# Altium schematic sheet 06_PowerRele_OnOff.SchDoc
size A4; Organization: OLTEST; Revision: 01; SheetNumber: 6; SheetTotal: 13; Название листа: Название листа; Разработчик: Бондарчук С.; Прибор: R100; АМАК.000000.000 Э3: R100.230.030.000-00; Дата: 16.04.2019; Формат: A4; Workspacename: R100_Boards_v1; PageSetup: Record=PageOptions|CenterHorizontal=True|CenterVertical=True|PrintScale=0.97|XCorrection=1.00|YCorrection=1.00|PrintKind=0|BorderSize=5000000|LeftOffset=0|BottomOffset=0|Orientation=2|PaperLength=1000|PaperWidth=1000|Scale=100|PaperSource=7|PrintQuality=-3|MediaType=1|DitherType=10|PrintScaleMode=1|PaperKind=A4|PaperIndex=9
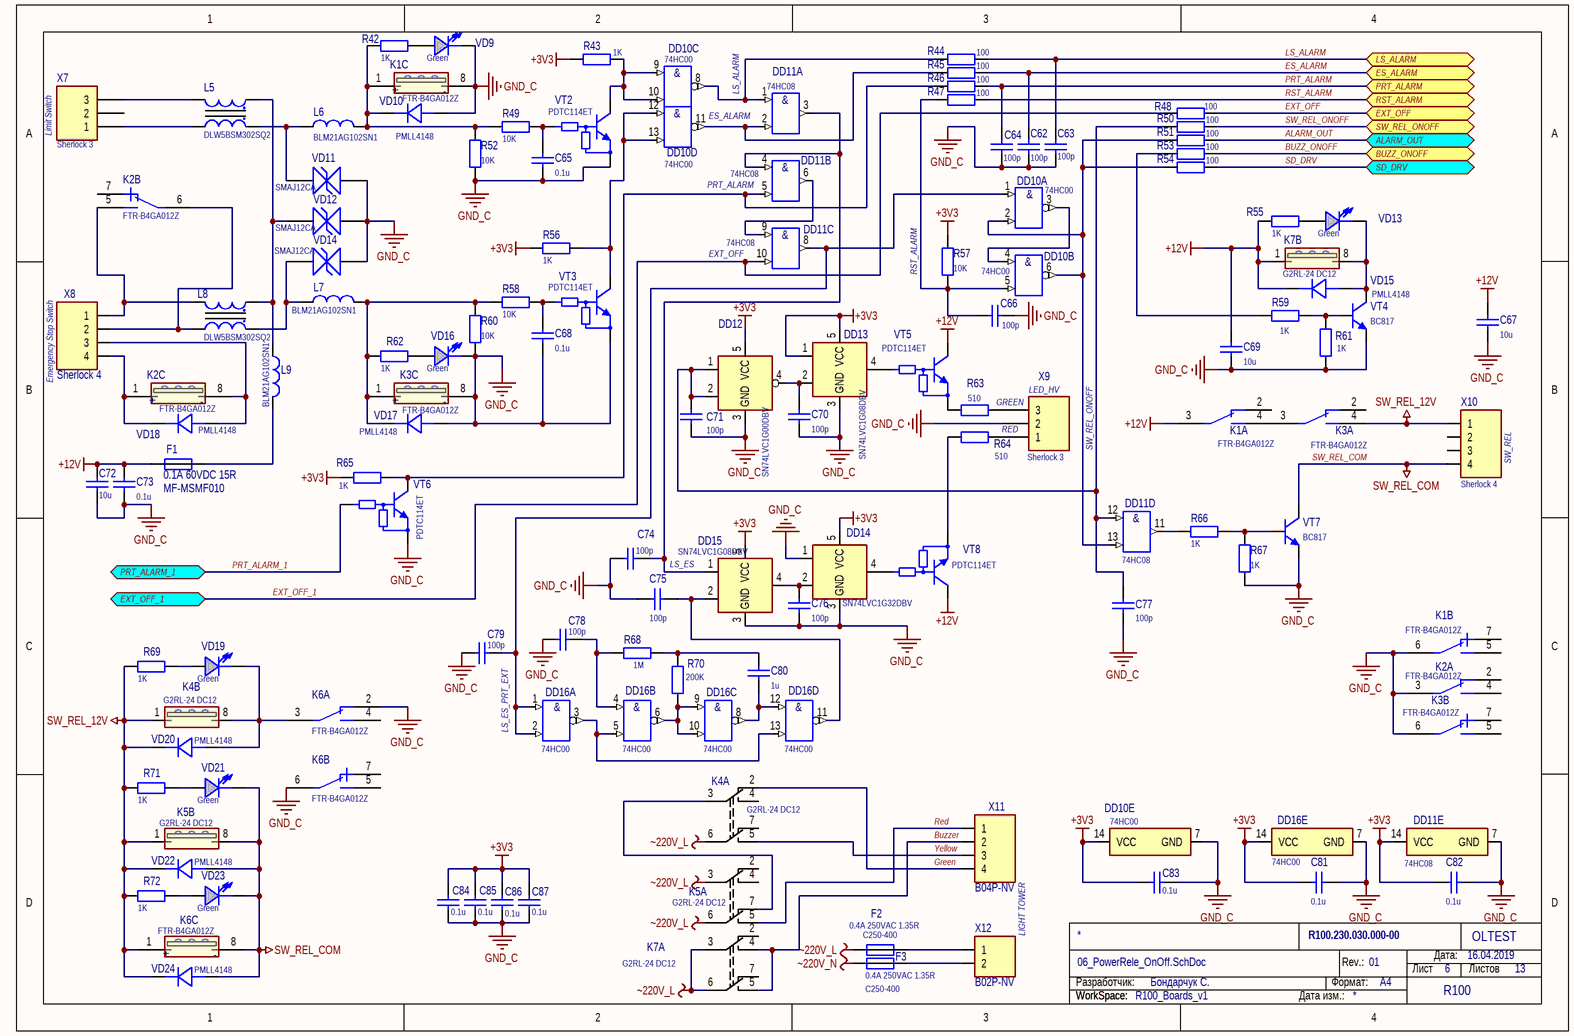
[diagram p0: 06_PowerRele_OnOff.SchDoc]

## Parts
C62  100p  [SMD_C_0603]
C63  100p  [SMD_C_0603]
C64  100p  [SMD_C_0603]
C65  0.1u  [SMD_C_0603]
C66  100p  [SMD_C_0603]
C67  10u  [SMD_C_1206]
C68  0.1u  [SMD_C_0603]
C69  10u  [SMD_C_1206]
C70  100p  [SMD_C_0603]
C71  100p  [SMD_C_0603]
C72  10u  [SMD_C_1206]
C73  0.1u  [SMD_C_0603]
C74  100p  [SMD_C_0603]
C75  100p  [SMD_C_0603]
C76  100p  [SMD_C_0603]
C77  100p  [SMD_C_0603]
C78  100p  [SMD_C_0603]
C79  100p  [SMD_C_0603]
C80  1u  [SMD_C_0603]
C81  0.1u  [SMD_C_0603]
C82  0.1u  [SMD_C_0603]
C83  0.1u  [SMD_C_0603]
C84  0.1u  [SMD_C_0603]
C85  0.1u  [SMD_C_0603]
C86  0.1u  [SMD_C_0603]
C87  0.1u  [SMD_C_0603]
DD10  74HC00  [TSSOP14]  (parts A,B,C,D,E of 5)
DD11  74HC08  [TSSOP14]  (parts A,B,C,D,E of 5)
DD12  SN74LVC1G00DBV  [SOT-23(DBV)]
DD13  SN74LVC1G08DBV  [SOT-23(DBV)]
DD14  SN74LVC1G32DBV  [SOT-23(DBV)]
DD15  SN74LVC1G08DBV  [SOT-23(DBV)]
DD16  74HC00  [TSSOP14]  (parts A,B,C,D,E of 5)
F1  0.1A 60VDC 15R  [MF-MSMF010]
F2  0.4A 250VAC 1.35R  [C250-400]
F3  0.4A 250VAC 1.35R  [C250-400]
K1  FTR-B4GA012Z  [FTR-B4GA]  (parts A,B,C of 3)
K2  FTR-B4GA012Z  [FTR-B4GA]  (parts A,B,C of 3)
K3  FTR-B4GA012Z  [FTR-B4GA]  (parts A,B,C of 3)
K4  G2RL-24 DC12  [G2RL]  (parts A,B of 2)
K5  G2RL-24 DC12  [G2RL]  (parts A,B of 2)
K6  FTR-B4GA012Z  [FTR-B4GA]  (parts A,B,C of 3)
K7  G2RL-24 DC12  [G2RL]  (parts A,B of 2)
L5  DLW5BSM302SQ2  [DLW5BS(AH)]
L6  BLM21AG102SN1  [SMD_L_L2_W1.25]
L7  BLM21AG102SN1  [SMD_L_L2_W1.25]
L8  DLW5BSM302SQ2  [DLW5BS(AH)]
L9  BLM21AG102SN1  [SMD_L_L2_W1.25]
R42  1K  [SMD_R_1206]
R43  1K  [SMD_R_0603]
R44  100  [SMD_R_0603]
R45  100  [SMD_R_0603]
R46  100  [SMD_R_0603]
R47  100  [SMD_R_0603]
R48  100  [SMD_R_0603]
R49  10K  [SMD_R_0603]
R50  100  [SMD_R_0603]
R51  100  [SMD_R_0603]
R52  10K  [SMD_R_0603]
R53  100  [SMD_R_0603]
R54  100  [SMD_R_0603]
R55  1K  [SMD_R_1206]
R56  1K  [SMD_R_0603]
R57  10K  [SMD_R_0603]
R58  10K  [SMD_R_0603]
R59  1K  [SMD_R_0805]
R60  10K  [SMD_R_0603]
R61  1K  [SMD_R_0805]
R62  1K  [SMD_R_1206]
R63  510  [SMD_R_1206]
R64  510  [SMD_R_1206]
R65  1K  [SMD_R_0603]
R66  1K  [SMD_R_0805]
R67  1K  [SMD_R_0805]
R68  1M  [SMD_R_0805]
R69  1K  [SMD_R_1206]
R70  200K  [SMD_R_0805]
R71  1K  [SMD_R_1206]
R72  1K  [SMD_R_1206]
VD9  value Green  [SMD_LED_LL_Green]  (hidden comment: LL-S172GC-2A)
VD10  PMLL4148  [SOD80C]
VD11  SMAJ12CA  [DO-214AC noPolarity]
VD12  SMAJ12CA  [DO-214AC noPolarity]
VD13  value Green  [SMD_LED_LL_Green]  (hidden comment: LL-S172GC-2A)
VD14  SMAJ12CA  [DO-214AC noPolarity]
VD15  PMLL4148  [SOD80C]
VD16  value Green  [SMD_LED_LL_Green]  (hidden comment: LL-S172GC-2A)
VD17  PMLL4148  [SOD80C]
VD18  PMLL4148  [SOD80C]
VD19  value Green  [SMD_LED_LL_Green]  (hidden comment: LL-S172GC-2A)
VD20  PMLL4148  [SOD80C]
VD21  value Green  [SMD_LED_LL_Green]  (hidden comment: LL-S172GC-2A)
VD22  PMLL4148  [SOD80C]
VD23  value Green  [SMD_LED_LL_Green]  (hidden comment: LL-S172GC-2A)
VD24  PMLL4148  [SOD80C]
VT2  PDTC114ET  [SOT23-3]
VT3  PDTC114ET  [SOT23-3]
VT4  BC817  [SOT23-3]
VT5  PDTC114ET  [SOT23-3]
VT6  PDTC114ET  [SOT23-3]
VT7  BC817  [SOT23-3]
VT8  PDTC114ET  [SOT23-3]
X7  Sherlock 3  [35362-0350]
X8  Sherlock 4  [35362-0450]
X9  Sherlock 3  [35362-0350]
X10  Sherlock 4  [35362-0450]
X11  B04P-NV  [B04P-NV (power)]
X12  B02P-NV  [B02P-NV]

## Ports
ALARM_OUT, BUZZ_ONOFF, ES_ALARM, EXT_OFF, EXT_OFF_1, LS_ALARM, PRT_ALARM, PRT_ALARM_1, RST_ALARM, SD_DRV (bidir), SW_REL_ONOFF

## Nets
+3V3: C81.1 C82.1 C83.1 C84.2 C85.2 C86.2 C87.2 DD10.14(VCC) DD11.14(VCC) DD12.5(VCC) DD13.1 DD13.5(VCC) DD14.5(VCC) DD15.5(VCC) DD16.14(VCC) R43.2 R56.2 R57.1 R65.2
+12V: C67.2 C69.2 C72.2 C73.2 F1.1 K1.3 K7.1 R55.1 VD15.2(CATHODE) VT5.3(C) VT8.3(C)
GND_C: C62.1 C63.1 C64.1 C65.1 C66.1 C67.1 C68.1 C69.1 C70.2 C71.1 C72.1 C73.1 C74.2 C75.2 C76.2 C77.2 C78.2 C79.2 C81.2 C82.2 C83.2 C84.1 C85.1 C86.1 C87.1 DD10.7(GND) DD11.7(GND) DD12.3(GND) DD13.3(GND) DD14.1 DD14.3(GND) DD15.3(GND) DD16.7(GND) K1.6 K1.8 K2.3 K3.6 K3.8 K6.2 K6.6 R52.1 R60.1 R61.1 R67.1 VD9.2(CATHODE) VD10.1(ANODE) VD11.2 VD12.2 VD14.2 VD16.2(CATHODE) VD17.1(ANODE) VT2.2(E) VT3.2(E) VT4.2(E) VT6.2(E) VT7.2(E) X9.2
SW_REL_12V: K3.4 K4.1 K5.1 K6.1 R69.1 R71.1 R72.1 VD20.2(CATHODE) VD22.2(CATHODE) VD24.2(CATHODE) X10.1
SW_REL_COM: K5.8 K6.8 VD21.2(CATHODE) VD22.1(ANODE) VD23.2(CATHODE) VD24.1(ANODE) VT7.3(C) X10.4
~220V_L: F2.1 K4.6 K5.3 K5.6 K7.3 K7.6
~220V_N: F3.1
ALARM_OUT: R51.2 ; port ALARM_OUT
BUZZ_ONOFF: R53.2 ; port BUZZ_ONOFF
Buzzer: K7.4 K7.5 X11.2
ES_ALARM: C62.2 R45.2 ; port ES_ALARM
EXT_OFF: R48.2 ; port EXT_OFF
EXT_OFF_1: DD11.10(3B) R48.1 ; port EXT_OFF_1
Green: K4.2 X11.4
LS_ALARM: C63.2 R44.2 ; port LS_ALARM
PRT_ALARM: C64.2 R46.2 ; port PRT_ALARM
PRT_ALARM_1: VT6.1(B) ; port PRT_ALARM_1
Red: K5.5 X11.1
RST_ALARM: R47.2 ; port RST_ALARM
SD_DRV: R54.2 ; port SD_DRV
SW_REL_ONOFF: R50.2 ; port SW_REL_ONOFF
Yellow: K4.5 X11.3
NetC65_2: C65.2 R49.2 VT2.1(B)
NetC66_2: C66.2 DD10.5(2B) R47.1 R57.2
NetC68_2: C68.2 R58.2 VT3.1(B)
NetC70_1: C70.1 DD12.4 DD13.2
NetC71_2: C71.2 C77.1 DD11.12(4A) DD12.1 DD12.2 R50.1
NetC74_1: C74.1 DD11.3(1Y) DD11.4(2A) DD15.1
NetC75_1: C75.1 DD15.2 DD16.11(4Y)
NetC76_1: C76.1 DD14.2 DD15.4
NetC78_1: C78.1 DD16.4(2A) R68.1
NetC79_1: C79.1 DD10.1(1A) DD11.8(3Y) DD16.1(1A) DD16.2(1B)
NetC80_1: C80.1 DD16.8(3Y) DD16.12(4A)
NetC80_2: C80.2 R68.2 R70.2
NetDD10_2: DD10.2(1B) DD10.6(2Y) DD11.13(4B) R51.1 R54.1
NetDD10_3: DD10.3(1Y) DD10.4(2A)
NetDD10_8: DD10.8(3Y) DD11.1(1A) R44.1
NetDD10_9: DD10.9(3A) DD10.10(3B) R43.1 VT2.3(C)
NetDD10_11: DD10.11(4Y) DD11.2(1B) R45.1
NetDD10_12: DD10.12(4A) DD10.13(4B) R56.1 VT3.3(C)
NetDD11_5: DD11.5(2B) R46.1 R65.1 VT6.3(C)
NetDD11_6: DD11.6(2Y) DD11.9(3A)
NetDD11_11: DD11.11(4Y) R66.1
NetDD13_4: DD13.4 VT5.1(B)
NetDD14_4: DD14.4 VT8.1(B)
NetDD16_3: DD16.3(1Y) DD16.5(2B) DD16.13(4B)
NetDD16_6: DD16.6(2Y) DD16.9(3A) DD16.10(3B) R70.1
NetF1_2: F1.2 L9.2
NetF2_2: F2.2 X12.1
NetF3_2: F3.2 X12.2
NetK1_1: K1.1 L6.2 R42.1 R49.1 R52.2 VD10.2(CATHODE)
NetK1_4: K1.4 K3.3
NetK2_1: K2.1 VD18.2(CATHODE) X8.4
NetK2_5: K2.5 L8.2 X8.1
NetK2_6: K2.6 L8.3 X8.2
NetK2_8: K2.8 VD18.1(ANODE) X8.3
NetK3_1: K3.1 L7.2 R58.1 R60.2 R62.1 VD17.2(CATHODE)
NetK4_3: K4.3 K5.7
NetK4_8: K4.8 K6.3 VD19.2(CATHODE) VD20.1(ANODE)
NetK7_8: K7.8 VD13.2(CATHODE) VD15.1(ANODE) VT4.3(C)
NetL5_1: L5.1 L6.1 VD11.1
NetL5_2: L5.2 X7.1
NetL5_3: L5.3 X7.3
NetL5_4: L5.4 L8.1 L9.1 VD12.1
NetL7_1: L7.1 L8.4 VD14.1
NetR42_2: R42.2 VD9.1(ANODE)
NetR53_1: R53.1 R59.1
NetR55_2: R55.2 VD13.1(ANODE)
NetR59_2: R59.2 R61.2 VT4.1(B)
NetR62_2: R62.2 VD16.1(ANODE)
NetR63_1: R63.1 VT5.2(E)
NetR63_2: R63.2 X9.3
NetR64_1: R64.1 VT8.2(E)
NetR64_2: R64.2 X9.1
NetR66_2: R66.2 R67.2 VT7.1(B)
NetR69_2: R69.2 VD19.1(ANODE)
NetR71_2: R71.2 VD21.1(ANODE)
NetR72_2: R72.2 VD23.1(ANODE)

Not connected (* = marked no-connect by the designer): K1 2 5 7; K2 2 4 7; K3 2 5 7; K4 4 7; K5 2 4; K6 4 5 7; K7 2 7; X7 2; X10 2 3

## Notes on the sheet
- LS_ALARM
- (near X7) Limit Switch
- (near DD10) ES_ALARM
- (near DD11) PRT_ALARM
- (near DD11) EXT_OFF
- (near R57) RST_ALARM
- (near X8) Emergency Stop Switch
- GREEN
- RED
- (near X9) LED_HV
- SW_REL_ONOFF
- (near X10) SW_REL
- LS_ES
- LS_ES_PRT_EXT
- LIGHT TOWER
- Разработчик:
- Формат:
- Rev.:
- Лист
- Дата:
- Листов
- WorkSpace:
- Дата изм.:
- (in symbol 74HC00, part A) &
- (in symbol 74HC00, part B) &
- (in symbol 74HC00, part C) &
- (in symbol 74HC00, part D) &
- (in symbol 74HC08, part A) &
- (in symbol 74HC08, part B) &
- (in symbol 74HC08, part C) &
- (in symbol 74HC08, part D) &
- (in symbol FTR-B4GA012Z, part C) -; +
- (in symbol SN74LVC1G00DBV) &
- (in symbol SN74LVC1G08DBV) &

## Library data of the parts
C62-C64 C66 C70 C71 C74-C79 = C0603 100p 100V 5%: SMD C 0603 MURATA 100V 5% NP0; PartNumber: GRM1885C2A101JA01; Manufacturer: MURATA; Value: 100p
C65 C68 C73 C81-C87 = C0603 0.1u 50V 10%: SMD C 0603 MURATA 50V 10% X7R; PartNumber: GRM188R71H104K; Manufacturer: MURATA; Value: 0.1u
C67 C69 C72 = C1206 10u 25V 20%: SMD C 1206 MURATA 25V 20% X5R; PartNumber: GRM31MR61E106M; Manufacturer: MURATA; Value: 10u
C80 = C0603 1uF 25V 10%: SMD C 0603 MURATA 25V 10% X7R; PartNumber: GRM188R71E105KA12; Manufacturer: MURATA; Value: 1u
DD10 DD16 = 74HC00: Quad 2-Input Positive-NAND Gates, PW0014A; Generic Part Number: SN74HC00; Manufacturer: Texas Instruments; PartNumber: SN74HC00PW; VCC(Min)(V): 2; VCC(Max)(V): 6; Output Type: CMOS; ICC @ Nom Voltage(Max)(mA): 0.02; Bits(#): 4; F @ Nom Voltage(Max)(Mhz): 70; Technology Family: HC; Voltage(Nom)(V): 5; Schmitt Trigger: Yes; Output Drive (IOL/IOH)(Max)(mA): 5.2/-5.2; tpd @ Nom Voltage(Max)(ns): 23; PackageReference: PW0014A; Input Type: CMOS; Operating Temperature Range(C): -40 to 85
DD11 = 74HC08: Quad 2-Input Positive-NAND Gates, PW0014A; Generic Part Number: SN74HC00; Manufacturer: Texas Instruments; PartNumber: SN74HC08PW; VCC(Min)(V): 2; VCC(Max)(V): 6; Output Type: CMOS; ICC @ Nom Voltage(Max)(mA): 0.02; Bits(#): 4; F @ Nom Voltage(Max)(Mhz): 70; Technology Family: HC; Voltage(Nom)(V): 5; Schmitt Trigger: Yes; Output Drive (IOL/IOH)(Max)(mA): 5.2/-5.2; tpd @ Nom Voltage(Max)(ns): 23; PackageReference: PW0014A; Input Type: CMOS; Operating Temperature Range(C): -40 to 85
DD12 = SN74LVC1G00DBV: 2-in NAND; Manufacturer: Texas Instruments; PartNumber: SN74LVC1G00DBV
DD13 DD15 = SN74LVC1G08DBV: 2-in AND; Manufacturer: Texas Instruments; PartNumber: SN74LVC1G08DBV
DD14 = SN74LVC1G32DBV: 2-in OR; Manufacturer: Texas Instruments; PartNumber: SN74LVC1G32DBV
F1 = MF-MSMF010 (0.1A 60VDC 15R): PTC Resettable Fusses 0.1A 60VDC 15R; Manufacturer: BOURNS; PartNumber: MF-MSMF010
F2 F3 = C250-400 (0.4A 250VAC 1.35R): PTC Resettable Fusses 0.4A 250VAC 1.35R; Manufacturer: SEA&LAND ELECTRONIC CORP.; PartNumber: C250-400
K1-K3 K6 = FTR-B4GA012Z: 250VAC 1A DPDT 12VDC; Manufacturer: Fujitsu; PartNumber: FTR-B4GA012Z
K4 K5 K7 = G2RL-24 DC12: 440VAC 8A DPDT 12VDC; Manufacturer: Omron; PartNumber: G2RL-24 DC12
L5 L8 = DLW5BSM302SQ2: SMD Common Mode Choke Coil 0.5A Z = 3000 Ohm / 100 MHz; Manufacturer: MURATA; PartNumber: DLW5BSM302SQ2
L6 L7 L9 = BLM21AG102SN1: 1000R 0.6A (100MHz); Manufacturer: TDK; Value: 1000R 0.6A (100MHz); PartNumber: BLM21AG102SN1
R42 R55 R62 R69 R71 R72 = R1206 1K 1%: SMD R 1206 VISHAY 0.25W 200V 1% 100ppm; PartNumber: CRCW12061K00FK; Manufacturer: VISHAY; Value: 1K
R43 R56 R65 = R0603 1K 1%: SMD R 0603 VISHAY 0.1W 75V 1% 100ppm; PartNumber: CRCW06031K00FK; Manufacturer: VISHAY; Value: 1K
R44-R48 R50 R51 R53 R54 = R0603 100 1%: SMD R 0603 VISHAY 0.1W 75V 1% 100ppm; PartNumber: CRCW0603100RFK; Manufacturer: VISHAY; Value: 100
R49 R52 R57 R58 R60 = R0603 10К 1%: SMD R 0603 VISHAY 0.1W 75V 1% 100ppm; PartNumber: CRCW060310K0FK; Manufacturer: VISHAY; Value: 10K
R59 R61 R66 R67 = R0805 1K 1%: SMD R 0805 VISHAY 0.125W 150V 1% 100ppm; PartNumber: CRCW08051K00FK; Manufacturer: VISHAY; Value: 1K
R63 R64 = R1206 510 1%: SMD R 1206 VISHAY 0.25W 200V 1% 100ppm; PartNumber: CRCW1206510RFK; Manufacturer: VISHAY; Value: 510
R68 = R0805 1M 1%: SMD R 0805 VISHAY 0.125W 150V 1% 100ppm; PartNumber: CRCW08051M00FK; Manufacturer: VISHAY; Value: 1M
R70 = R0805 200K 1%: SMD R 0805 VISHAY 0.125W 150V 1% 100ppm; PartNumber: CRCW0805200KFK; Manufacturer: VISHAY; Value: 200K
VD9 VD13 VD16 VD19 VD21 VD23 = LL-S172GC-2A: LED Green SMD; Manufacturer: Lucky Light; PartNumber: LL-S172GC-2A
VD10 VD15 VD17 VD18 VD20 VD22 VD24 = PMLL4148: If=0.2A, Vf=1V Vrrm=100V Diode (SOD80C); Manufacturer: NXP Semiconductors; PartNumber: PMLL4148
VD11 VD12 VD14 = SMAJ12CA: 400W 12V  Transient Voltage Suppressor, Bidirectional; Manufacturer: LITTELFUSE; PartNumber: SMAJ12CA
VT2 VT3 VT5 VT6 VT8 = PDTC114ET: Digital Transistor (BRT), R1=10 kOhm, R2=10 kOhm, NPN Transistor; Manufacturer: On Semiconductor; PartNumber: PDTC114ET
VT4 VT7 = BC817: NPN Silicon, 3-Pin SOT-23; Manufacturer: NXP; PartNumber: BC817
X7 X9 = 35362-0350: Sherlock 3 Top, 2A 125V 2mm; Manufacturer: MOLEX; PartNumber: 35362-0350
X8 X10 = 35362-0450: Sherlock 4 Top, 2A 125V 2mm; Manufacturer: MOLEX; PartNumber: 35362-0450
X11 = B04P-NV: NV 4 конт LS=5.0 10A 250V PCB; Manufacturer: JST; PartNumber: B04P-NV
X12 = B02P-NV: NV 2 LS=5.0 10A 250V PCB; Manufacturer: JST; PartNumber: B02P-NV